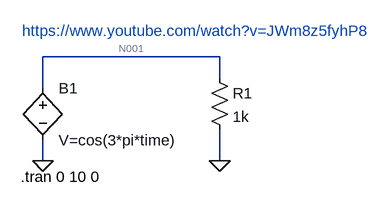
[diagram p0: schematic Behavioral_Sources.asc]
Behavioral_Sources.asc, the LTspice schematic file:
Version 4
SHEET 1 880 680
WIRE 240 96 -32 96
WIRE 240 128 240 96
WIRE -32 144 -32 96
WIRE -32 256 -32 224
WIRE 240 256 240 208
FLAG 240 256 0
FLAG -32 256 0
SYMBOL bv -32 128 R0
SYMATTR InstName B1
SYMATTR Value V=cos(3*pi*time)
SYMBOL res 224 112 R0
SYMATTR InstName R1
SYMATTR Value 1k
TEXT -66 280 Left 2 !.tran 0 10 0
TEXT -64 56 Left 2 ;https://www.youtube.com/watch?v=JWm8z5fyhP8

The netlist it stands for:
* Behavioral_Sources.asc
B1 N001 0 V=cos(3*pi*time)
R1 N001 0 1k
.tran 0 10 0
* https://www.youtube.com/watch?v=JWm8z5fyhP8
.backanno
.end

* Results of the author's LTspice run, read from the files saved beside the schematic
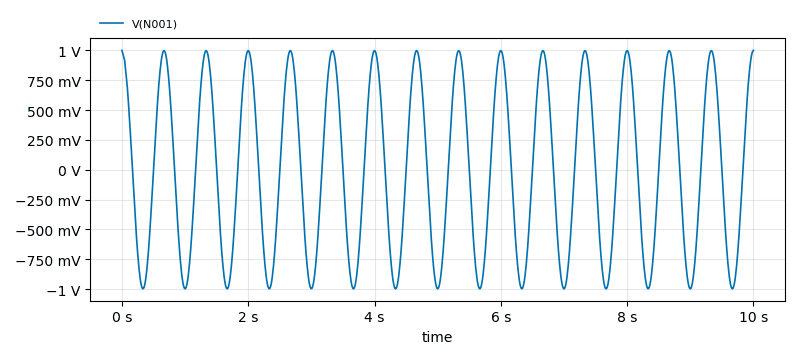
[diagram p1: Transient Analysis of Behavioral_Sources.asc, plotted from the saved traces]
* Transient Analysis, 1 run:
*   V(N001): min -997.9 mV, max 1 V, average -92 µV, rms 705.5 mV, last 1 V